# Altium schematic sheet fpga.SchDoc: CS - FPGA
size Letter; CheckedBy: J. Brinton; CompanyName: Signal Laboratories, Inc.; DrawnBy: J. Brinton; Engineer: J. Brinton; Address1: 3479 Edison Way; Address2: Menlo Park CA 94025; Address3: +1 (877) 778-8435; Address4: siglabs.com; Revision: 3; SheetNumber: 4; SheetTotal: 47
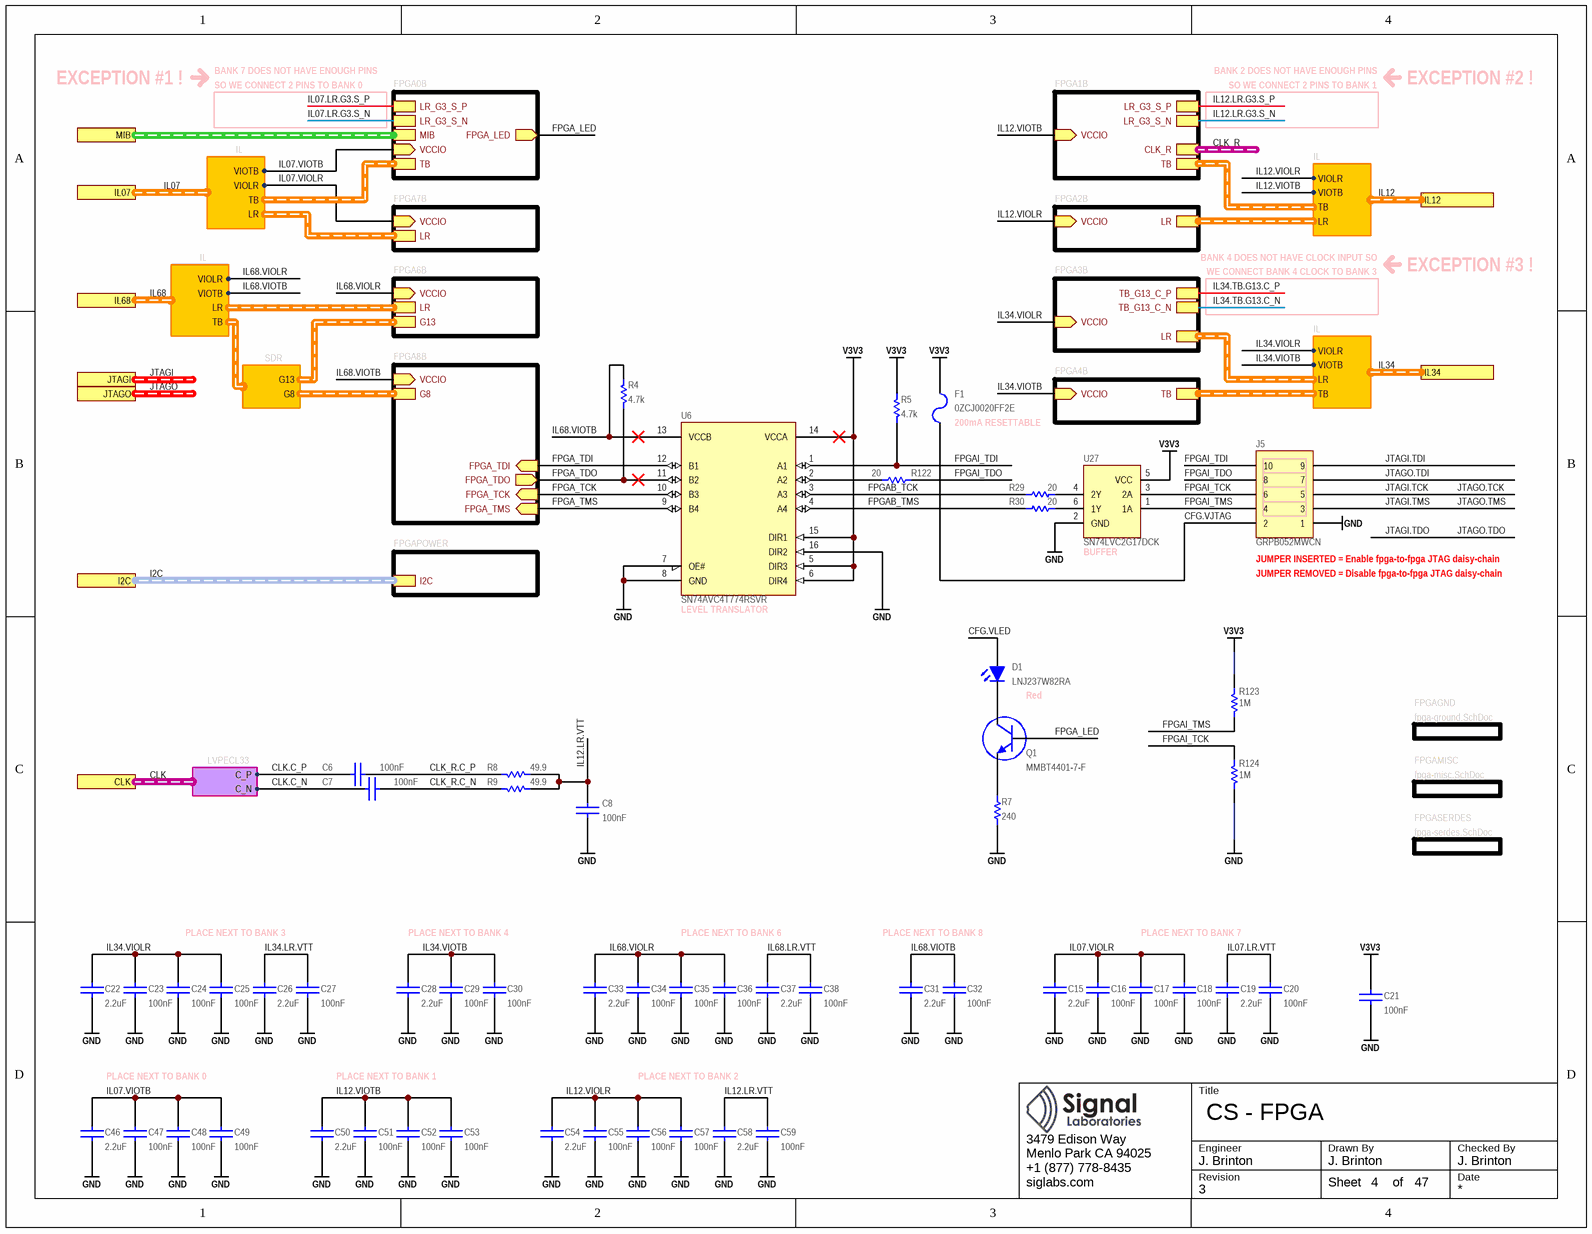
[diagram p0: fpga.SchDoc]

## Parts
C6  value 100nF  [CAPC100X50X55L25N]  (hidden comment: GCM155R71H104KE02)
C7  value 100nF  [CAPC100X50X55L25N]  (hidden comment: GCM155R71H104KE02)
C8  value 100nF  [CAPC100X50X55L25N]  (hidden comment: GCM155R71H104KE02)
C15  value 2.2uF  [CAPC160X80X90L20N]  (hidden comment: C1608X7R1A225M080)
C16  value 100nF  [CAPC100X50X55L25N]  (hidden comment: GCM155R71H104KE02)
C17  value 100nF  [CAPC100X50X55L25N]  (hidden comment: GCM155R71H104KE02)
C18  value 100nF  [CAPC100X50X55L25N]  (hidden comment: GCM155R71H104KE02)
C19  value 2.2uF  [CAPC160X80X90L20N]  (hidden comment: C1608X7R1A225M080)
C20  value 100nF  [CAPC100X50X55L25N]  (hidden comment: GCM155R71H104KE02)
C21  value 100nF  [CAPC100X50X55L25N]  (hidden comment: GCM155R71H104KE02)
C22  value 2.2uF  [CAPC160X80X90L20N]  (hidden comment: C1608X7R1A225M080)
C23  value 100nF  [CAPC100X50X55L25N]  (hidden comment: GCM155R71H104KE02)
C24  value 100nF  [CAPC100X50X55L25N]  (hidden comment: GCM155R71H104KE02)
C25  value 100nF  [CAPC100X50X55L25N]  (hidden comment: GCM155R71H104KE02)
C26  value 2.2uF  [CAPC160X80X90L20N]  (hidden comment: C1608X7R1A225M080)
C27  value 100nF  [CAPC100X50X55L25N]  (hidden comment: GCM155R71H104KE02)
C28  value 2.2uF  [CAPC160X80X90L20N]  (hidden comment: C1608X7R1A225M080)
C29  value 100nF  [CAPC100X50X55L25N]  (hidden comment: GCM155R71H104KE02)
C30  value 100nF  [CAPC100X50X55L25N]  (hidden comment: GCM155R71H104KE02)
C31  value 2.2uF  [CAPC160X80X90L20N]  (hidden comment: C1608X7R1A225M080)
C32  value 100nF  [CAPC100X50X55L25N]  (hidden comment: GCM155R71H104KE02)
C33  value 2.2uF  [CAPC160X80X90L20N]  (hidden comment: C1608X7R1A225M080)
C34  value 100nF  [CAPC100X50X55L25N]  (hidden comment: GCM155R71H104KE02)
C35  value 100nF  [CAPC100X50X55L25N]  (hidden comment: GCM155R71H104KE02)
C36  value 100nF  [CAPC100X50X55L25N]  (hidden comment: GCM155R71H104KE02)
C37  value 2.2uF  [CAPC160X80X90L20N]  (hidden comment: C1608X7R1A225M080)
C38  value 100nF  [CAPC100X50X55L25N]  (hidden comment: GCM155R71H104KE02)
C46  value 2.2uF  [CAPC160X80X90L20N]  (hidden comment: C1608X7R1A225M080)
C47  value 100nF  [CAPC100X50X55L25N]  (hidden comment: GCM155R71H104KE02)
C48  value 100nF  [CAPC100X50X55L25N]  (hidden comment: GCM155R71H104KE02)
C49  value 100nF  [CAPC100X50X55L25N]  (hidden comment: GCM155R71H104KE02)
C50  value 2.2uF  [CAPC160X80X90L20N]  (hidden comment: C1608X7R1A225M080)
C51  value 100nF  [CAPC100X50X55L25N]  (hidden comment: GCM155R71H104KE02)
C52  value 100nF  [CAPC100X50X55L25N]  (hidden comment: GCM155R71H104KE02)
C53  value 100nF  [CAPC100X50X55L25N]  (hidden comment: GCM155R71H104KE02)
C54  value 2.2uF  [CAPC160X80X90L20N]  (hidden comment: C1608X7R1A225M080)
C55  value 100nF  [CAPC100X50X55L25N]  (hidden comment: GCM155R71H104KE02)
C56  value 100nF  [CAPC100X50X55L25N]  (hidden comment: GCM155R71H104KE02)
C57  value 100nF  [CAPC100X50X55L25N]  (hidden comment: GCM155R71H104KE02)
C58  value 2.2uF  [CAPC160X80X90L20N]  (hidden comment: C1608X7R1A225M080)
C59  value 100nF  [CAPC100X50X55L25N]  (hidden comment: GCM155R71H104KE02)
D1  LNJ237W82RA  [0603_LED]
F1  0ZCJ0020FF2E  [1206]
J5  GRPB052MWCN  [GRPB052MWCN]
Q1  MMBT4401-7-F  [SOT23]
R4  value 4.7k  [RESC1005X40N]  (hidden comment: ERJ-2RKF4701X)
R5  value 4.7k  [RESC1005X40N]  (hidden comment: ERJ-2RKF4701X)
R7  value 240  [RESC1005X40N]  (hidden comment: ERJ-2RKF2400X)
R8  value 49.9  [RESC1005X40N]  (hidden comment: ERJ-2RKF49R9X)
R9  value 49.9  [RESC1005X40N]  (hidden comment: ERJ-2RKF49R9X)
R29  value 20  [RESC1005X40N]  (hidden comment: ERJ-2RKF20R0X)
R30  value 20  [RESC1005X40N]  (hidden comment: ERJ-2RKF20R0X)
R122  value 20  [RESC1005X40N]  (hidden comment: ERJ-2RKF20R0X)
R123  value 1M  [RESC1005X40N]  (hidden comment: ERJ-2RKF1004X)
R124  value 1M  [RESC1005X40N]  (hidden comment: ERJ-2RKF1004X)
U6  SN74AVC4T774RSVR  [RSV]
U27  SN74LVC2G17DCK  [DCK-6]

## Sub-sheets
FPGA0B = fpga-bank0.SchDoc: MIB (harness MIB), TB (harness SDR), VCCIO (in), FPGA_LED (out), LR_G3_S_N, LR_G3_S_P
FPGA1B = fpga-bank1.SchDoc: TB (harness SDR), VCCIO (in), CLK_R (harness LVPECL33), LR_G3_S_N, LR_G3_S_P
FPGA2B = fpga-bank2.SchDoc: LR (harness DDR), VCCIO (in)
FPGA3B = fpga-bank3.SchDoc: LR (harness DDR), TB_G13_C_P, TB_G13_C_N, VCCIO (in)
FPGA4B = fpga-bank4.SchDoc: TB (harness SDR), VCCIO (in)
FPGA6B = fpga-bank6.SchDoc: LR (harness DDR), G13 (harness GPIO13), VCCIO (in)
FPGA7B = fpga-bank7.SchDoc: LR (harness DDR), VCCIO (in)
FPGA8B = fpga-bank8.SchDoc: G8 (harness GPIO8), FPGA_TDO (out), FPGA_TDI (in), FPGA_TMS (in), FPGA_TCK (in), VCCIO (in)
FPGAGND = fpga-ground.SchDoc: no entries
FPGAMISC = fpga-misc.SchDoc: no entries
FPGAPOWER = fpga-power.SchDoc: I2C (harness I2C-3V3)
FPGASERDES = fpga-serdes.SchDoc: no entries

## Ports
CLK (harness LVPECL33), I2C (harness I2C-3V3), IL07 (harness IL), IL12 (harness IL), IL34 (harness IL), IL68 (harness IL), JTAGI (harness JTAG-3V3), JTAGO (harness JTAG-3V3), MIB (harness MIB)

## Harnesses
IL: LR, TB, VIOLR, VIOTB
SDR: G13, G8
IL: TB, LR, VIOLR, VIOTB
LVPECL33: C_P, C_N

## Nets
GND: C8.1 C15.1 C16.1 C17.1 C18.1 C19.1 C20.1 C21.1 C22.1 C23.1 C24.1 C25.1 C26.1 C27.1 C28.1 C29.1 C30.1 C31.1 C32.1 C33.1 C34.1 C35.1 C36.1 C37.1 C38.1 C46.1 C47.1 C48.1 C49.1 C50.1 C51.1 C52.1 C53.1 C54.1 C55.1 C56.1 C57.1 C58.1 C59.1 J5.1 R7.2 R124.2 U6.7(OE#) U6.8(GND) U6.16(DIR2) U27.2(GND)
V3V3: C21.2 F1.1 R5.2 R123.1 U6.5(DIR3) U6.6(DIR4) U6.14(VCCA) U6.15(DIR1) U27.5(VCC)
CFG.VJTAG: F1.2 J5.2
CFG.VLED: D1.1(A)
CLK.C_N: C7.2 ; port CLK.C_N
CLK.C_P: C6.2 ; port CLK.C_P
CLK_R.C_N: C7.1 R9.2
CLK_R.C_P: C6.1 R8.2
FPGA_LED: Q1.1(B) ; sheet FPGA0B/FPGA_LED
FPGA_TCK: U6.10(B3) ; sheet FPGA8B/FPGA_TCK
FPGA_TDI: U6.12(B1) ; sheet FPGA8B/FPGA_TDI
FPGA_TDO: R4.1 U6.11(B2) ; sheet FPGA8B/FPGA_TDO
FPGA_TMS: U6.9(B4) ; sheet FPGA8B/FPGA_TMS
FPGAB_TCK: R29.1 U6.3(A3)
FPGAB_TMS: R30.1 U6.4(A4)
FPGAI_TCK: J5.6 R124.1 U27.3(2A)
FPGAI_TDI: J5.10 R5.1 U6.1(A1)
FPGAI_TDO: J5.8 R122.2
FPGAI_TMS: J5.4 R123.2 U27.1(1A)
IL07.LR.G3.S_N: sheet FPGA0B/LR_G3_S_N
IL07.LR.G3.S_P: sheet FPGA0B/LR_G3_S_P
IL07.LR.VTT: C19.2 C20.2
IL07.VIOLR: C15.2 C16.2 C17.2 C18.2 ; sheet FPGA7B/VCCIO, port IL07.VIOLR
IL07.VIOTB: C46.2 C47.2 C48.2 C49.2 ; sheet FPGA0B/VCCIO, port IL07.VIOTB
IL12.LR.G3.S_N: sheet FPGA1B/LR_G3_S_N
IL12.LR.G3.S_P: sheet FPGA1B/LR_G3_S_P
IL12.LR.VTT: C8.2 C58.2 C59.2 R8.1 R9.1
IL12.VIOLR: C54.2 C55.2 C56.2 C57.2 ; sheet FPGA2B/VCCIO, port IL12.VIOLR
IL12.VIOTB: C50.2 C51.2 C52.2 C53.2 ; sheet FPGA1B/VCCIO, port IL12.VIOTB
IL34.LR.VTT: C26.2 C27.2
IL34.TB.G13.C_N: sheet FPGA3B/TB_G13_C_N
IL34.TB.G13.C_P: sheet FPGA3B/TB_G13_C_P
IL34.VIOLR: C22.2 C23.2 C24.2 C25.2 ; sheet FPGA3B/VCCIO, port IL34.VIOLR
IL34.VIOTB: C28.2 C29.2 C30.2 ; sheet FPGA4B/VCCIO, port IL34.VIOTB
IL68.LR.VTT: C37.2 C38.2
IL68.VIOLR: C33.2 C34.2 C35.2 C36.2 ; sheet FPGA6B/VCCIO, port IL68.VIOLR
IL68.VIOTB: C31.2 C32.2 R4.2 U6.13(VCCB) ; sheet FPGA8B/VCCIO, port IL68.VIOTB
JTAGI.TCK: J5.5  [also labelled JTAGO.TCK]
JTAGI.TDI: J5.9
JTAGI.TMS: J5.3  [also labelled JTAGO.TMS]
JTAGO.TDI: J5.7
NetD1_2: D1.2(K) Q1.3(C)
NetQ1_2: Q1.2(E) R7.1
NetR29_2: R29.2 U27.4(2Y)
NetR30_2: R30.2 U27.6(1Y)
NetR122_1: R122.1 U6.2(A2)

## Buses and harness runs
harness CLK = port CLK
harness CLK_R = sheet FPGA1B/CLK_R
harness I2C = port I2C = sheet FPGAPOWER/I2C
harness IL07 = port IL07
harness IL12 = port IL12
harness IL34 = port IL34
harness IL68 = port IL68
harness JTAGI = port JTAGI
harness JTAGO = port JTAGO
harness port MIB = sheet FPGA0B/MIB

## Notes on the sheet
- EXCEPTION #1 !
- BANK 7 DOES NOT HAVE ENOUGH PINS
- SO WE CONNECT 2 PINS TO BANK 0
- BANK 2 DOES NOT HAVE ENOUGH PINS
- SO WE CONNECT 2 PINS TO BANK 1
- EXCEPTION #2 !
- BANK 4 DOES NOT HAVE CLOCK INPUT SO
- WE CONNECT BANK 4 CLOCK TO BANK 3
- EXCEPTION #3 !
- (near F1) 200mA RESETTABLE
- (near U27) BUFFER
- (near J5) JUMPER INSERTED = Enable fpga-to-fpga JTAG daisy-chain
- (near J5) JUMPER REMOVED = Disable fpga-to-fpga JTAG daisy-chain
- (near U6) LEVEL TRANSLATOR
- Red
- PLACE NEXT TO BANK 3
- PLACE NEXT TO BANK 4
- PLACE NEXT TO BANK 6
- PLACE NEXT TO BANK 8
- PLACE NEXT TO BANK 7
- PLACE NEXT TO BANK 0
- PLACE NEXT TO BANK 1
- PLACE NEXT TO BANK 2
- Title
- Engineer
- Revision
- Drawn By
- Checked By
- Date
- Sheet
- of

## Library data of the parts
C6-C8 C16-C18 C20 C21 C23-C25 C27 C29 C30 C32 C34-C36 C38 C47-C49 C51-C53 C55-C57 C59 = CAP: Ceramic Capacitor 100nF ±10% 50V X7R 0402; Manufacturer: Murata; Tr: -55:125; Manufacturer P/N: GCM155R71H104KE02; Tolerance: ±10%; Voltage: 50V; Footprint: *; Package: 0402
C15 C19 C22 C26 C28 C31 C33 C37 C46 C50 C54 C58 = CAP: Ceramic Capacitor 2.2uF ±20% 10V X7R 0603; Manufacturer: TDK; Tr: -55:125; Manufacturer P/N: C1608X7R1A225M080; Tolerance: ±20%; Voltage: 10V; Footprint: *; Package: 0603
D1 = LED0603RD: LED, SMT 0603, Color Red, 5mA, 1.85V; Manufacturer: Panasonic; Manufacturer P/N: LNJ237W82RA; Package: 0603 Polarized
F1 = 0ZCJ0020FF2E: PTC Resettable Fuse, 0.2A, 30V, SMD 1206; Manufacturer: Bell Fuse; Manufacturer P/N: 0ZCJ0020FF2E; Package: 1206
J5 = GRPB052VWVN: Male Header, 0.050" Pitch, 2x5 Position, Right Angle; Manufacturer: Sullins; Manufacturer P/N: GRPB052MWCN
Q1 = MMBT4401-7-F: NPN Small Signal Transistor SMD SOT-23; Manufacturer: Diodes, Inc.; Manufacturer P/N: MMBT4401-7-F
R4 R5 = RES: Thick Film Resistor 4.7k ±1% 0.1W 75V 0402; Manufacturer: Panasonic; Tcr: ±100; Tr: -55:155; Voltage: 75; Power: 0.1; Tolerance: ±1%; Manufacturer P/N: ERJ-2RKF4701X; Alternatives: *; Footprint: *; Package: 0402
R7 = RES: Thick Film Resistor 240 ±1% 0.1W 75V 0402; Manufacturer: Panasonic; Tcr: ±100; Tr: -55:155; Voltage: 75; Power: 0.1; Tolerance: ±1%; Manufacturer P/N: ERJ-2RKF2400X; Alternatives: *; Footprint: *; Package: 0402
R8 R9 = RES: Thick Film Resistor 49.9 ±1% 0.1W 50V 0402; Manufacturer: Panasonic; Tcr: ±100; Tr: -55:155; Voltage: 50; Power: 0.1; Tolerance: ±1%; Manufacturer P/N: ERJ-2RKF49R9X; Alternatives: *; Footprint: *; Package: 0402
R29 R30 R122 = RES: Thick Film Resistor 20 ±1% 0.1W 75V 0402; Manufacturer: Panasonic; Tcr: ±100; Tr: -55:155; Voltage: 75; Power: 0.1; Tolerance: ±1%; Manufacturer P/N: ERJ-2RKF20R0X; Alternatives: *; Footprint: *; Package: 0402
R123 R124 = RES: Thick Film Resistor 1M ±1% 0.1W 75V 0402; Manufacturer: Panasonic; Tcr: ±100; Tr: -55:155; Voltage: 75; Power: 0.1; Tolerance: ±1%; Manufacturer P/N: ERJ-2RKF1004X; Alternatives: *; Footprint: *; Package: 0402
U6 = SN74AVC4T774RSVR: 4-Bit Dual-Supply Bus Transceiver; Manufacturer: Texas Instruments; Manufacturer P/N: SN74AVC4T774RSVR
U27 = SN74LVC2G17DCK: Dual Schmitt-Trigger Buffer; Manufacturer: Texas Instruments; Manufacturer P/N: SN74LVC2G17DCK